# Altium schematic sheet XP-Hardv.SchDoc
size A4
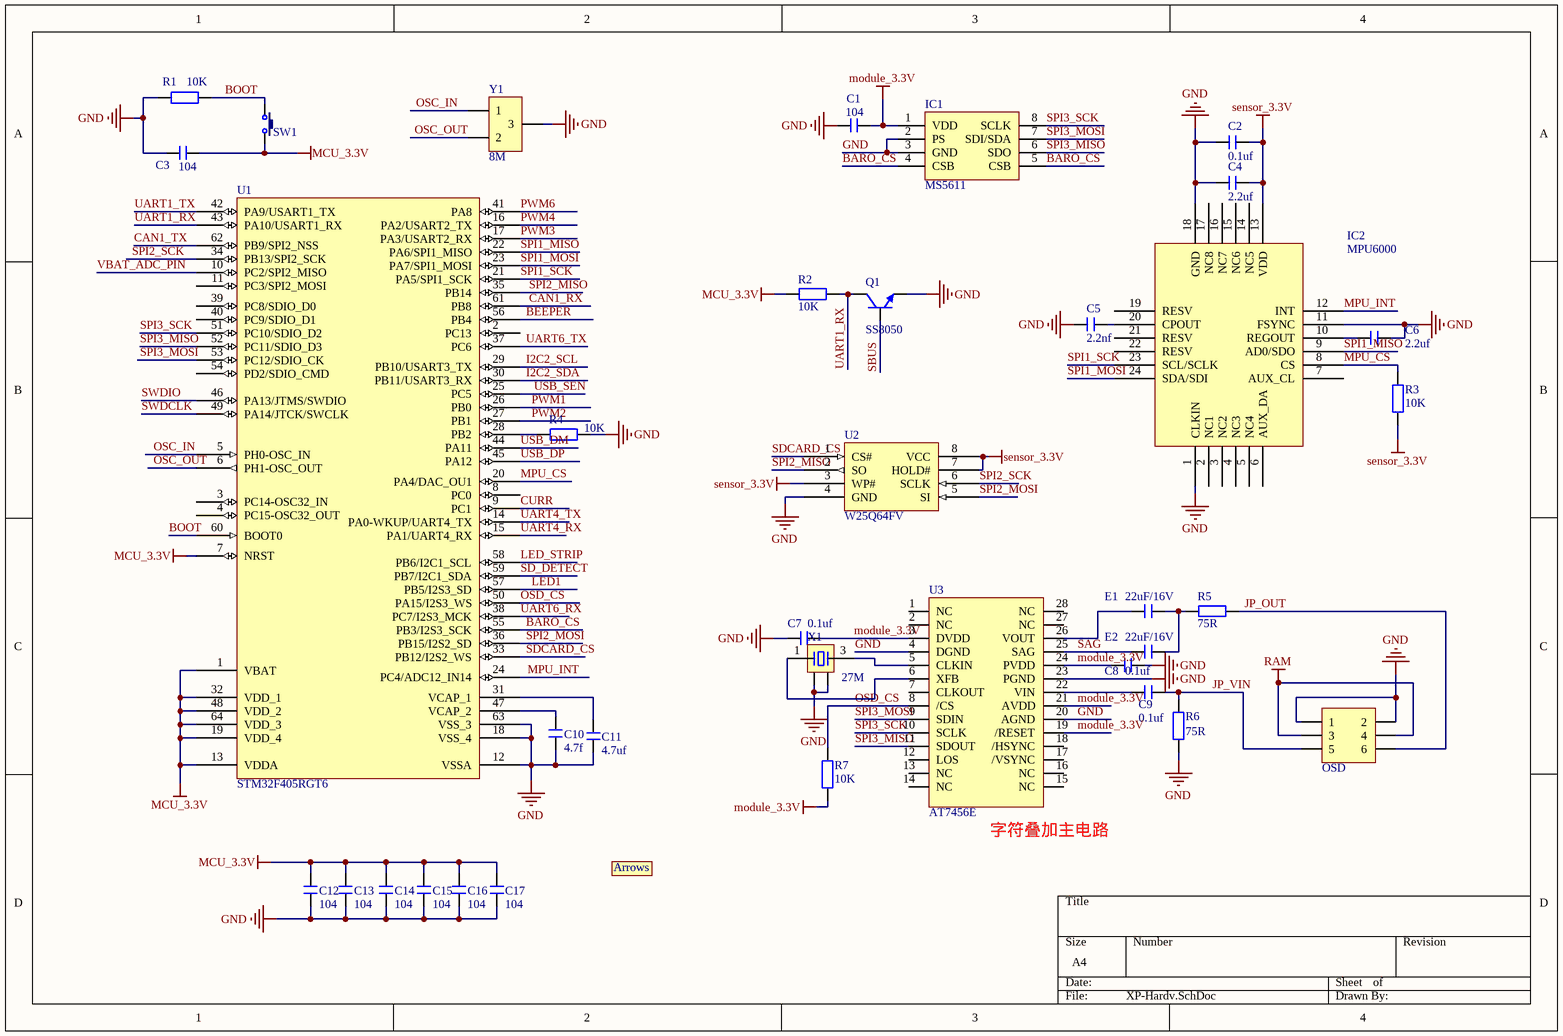
[diagram p0: XP-Hardv.SchDoc]

## Parts
C1  104  [C 0402_M]
C2  0.1uf  [C 0402_M]
C3  104  [C 0402_M]
C4  2.2uf  [C 0402_M]
C5  2.2nf  [C 0402_M]
C6  2.2uf  [C 0402_M]
C7  0.1uf  [C 0402_M]
C8  0.1uf  [C 0402_M]
C9  0.1uf  [C 0402_M]
C10  4.7f  [C 0402_M]
C11  4.7uf  [C 0402_M]
C12  104  [C 0402_M]
C13  104  [C 0402_M]
C14  104  [C 0402_M]
C15  104  [C 0402_M]
C16  104  [C 0402_M]
C17  104  [C 0402_M]
E1  22uF/16V  [C 0805_L]
E2  22uF/16V  [C 0805_L]
IC1  MS5611  [MS5611]
IC2  MPU6000  [MPU6050]
logo1  Arrows  [Arrows - E]  (value not drawn)
OSD  Header3X2  [PHD2.0-LI-2x3P]  (value not drawn)
Q1  SS8050  [SOT23-3M]
R1  10K  [R 0402_M]
R2  10K  [R 0402_M]
R3  10K  [R 0402_M]
R4  10K  [R 0402_M]
R5  75R  [R 0402_M]
R6  75R  [R 0402_M]
R7  10K  [R 0402_M]
SW1  3x6x5  [TSW 3*6*4.3-S-W]  (value not drawn)
U1  STM32F405RGT6  [LQFP64 10x10_N]
U2  W25Q64FV  [Q-WSON8_6x5]
U3  AT7456E  [AT7456E - B]
X1  27M  [OSC 3225-4P]
Y1  8M  [L - CSTCE-3213]

## Nets
GND: C1.2 C2.2 C3.1 C4.2 C5.2 C6.1 C7.1 C8.2 C10.1 C11.1 C12.1 C13.1 C14.1 C15.1 C16.1 C17.1 IC1.2(PS) IC1.3(GND) IC2.1(CLKIN) IC2.11(FSYNC) IC2.18(GND) OSD.1 OSD.2 Q1.2(E) R1.2 R4.2 R6.1 U1.12(VSSA) U1.18(VSS_4) U1.63(VSS_3) U2.4(GND) U3.4(DGND) U3.20(AGND) U3.23(PGND) X1.2 X1.4 Y1.3
MCU_3.3V: C3.2 C12.2 C13.2 C14.2 C15.2 C16.2 C17.2 R2.2 SW1.2 U1.1(VBAT) U1.7(NRST) U1.13(VDDA) U1.19(VDD_4) U1.32(VDD_1) U1.48(VDD_2) U1.64(VDD_3)
module_3.3V: C1.1 C7.2 C8.1 IC1.1(VDD) R7.1 U3.3(DVDD) U3.19(/RESET) U3.21(AVDD) U3.24(PVDD)
RAM: OSD.3 OSD.4
sensor_3.3V: C2.1 C4.1 IC2.13(VDD) R3.1 U2.3(WP#) U2.7(HOLD#) U2.8(VCC)
BARO_CS: IC1.4(CSB) IC1.5(CSB) U1.55(PB3/I2S3_SCK)
BEEPER: U1.56(PB4)
BOOT: R1.1 SW1.1 U1.60(BOOT0)
CAN1_RX: U1.61(PB8)
CAN1_TX: U1.62(PB9/SPI2_NSS)
CURR: U1.9(PC1)
I2C2_SCL: U1.29(PB10/USART3_TX)
I2C2_SDA: U1.30(PB11/USART3_RX)
JP_OUT: OSD.6 R5.2
JP_VIN: C9.2 OSD.5 R6.2
LED1: U1.57(PB5/I2S3_SD)
LED_STRIP: U1.58(PB6/I2C1_SCL)
MPU_CS: IC2.8(CS) R3.2 U1.20(PA4/DAC_OU1)
MPU_INT: IC2.12(INT) U1.24(PC4/ADC12_IN14)
OSC_IN: U1.5(PH0-OSC_IN) Y1.1
OSC_OUT: U1.6(PH1-OSC_OUT) Y1.2
OSD_CS: R7.2 U1.50(PA15/I2S3_WS) U3.8(/CS)
PWM1: U1.26(PB0)
PWM2: U1.27(PB1)
PWM3: U1.17(PA3/USART2_RX)
PWM4: U1.16(PA2/USART2_TX)
PWM6: U1.41(PA8)
SAG: E2.1 U3.25(SAG)
SBUS: Q1.1(B)
SD_DETECT: U1.59(PB7/I2C1_SDA)
SDCARD_CS: U1.33(PB12/I2S2_WS) U2.1(CS#)
SPI1_MISO: IC2.9(AD0/SDO) U1.22(PA6/SPI1_MISO)
SPI1_MOSI: IC2.24(SDA/SDI) U1.23(PA7/SPI1_MOSI)
SPI1_SCK: IC2.23(SCL/SCLK) U1.21(PA5/SPI1_SCK)
SPI2_MISO: U1.35(PB14) U2.2(SO)
SPI2_MOSI: U1.36(PB15/I2S2_SD) U2.5(SI)
SPI2_SCK: U1.34(PB13/SPI2_SCK) U2.6(SCLK)
SPI3_MISO: IC1.6(SDO) U1.52(PC11/SDIO_D3) U3.11(SDOUT)
SPI3_MOSI: IC1.7(SDI/SDA) U1.53(PC12/SDIO_CK) U3.9(SDIN)
SPI3_SCK: IC1.8(SCLK) U1.51(PC10/SDIO_D2) U3.10(SCLK)
SWDCLK: U1.49(PA14/JTCK/SWCLK)
SWDIO: U1.46(PA13/JTMS/SWDIO)
UART1_RX: Q1.3(C) R2.1 U1.43(PA10/USART1_RX)
UART1_TX: U1.42(PA9/USART1_TX)
UART4_RX: U1.15(PA1/UART4_RX)
UART4_TX: U1.14(PA0-WKUP/UART4_TX)
UART6_RX: U1.38(PC7/I2S3_MCK)
UART6_TX: U1.37(PC6)
USB_DM: U1.44(PA11)
USB_DP: U1.45(PA12)
USB_SEN: U1.25(PC5)
VBAT_ADC_PIN: U1.10(PC2/SPI2_MISO)
NetC5_1: C5.1 IC2.20(CPOUT)
NetC6_2: C6.2 IC2.10(REGOUT)
NetC9_1: C9.1 U3.22(VIN)
NetC10_2: C10.2 U1.47(VCAP_2)
NetC11_2: C11.2 U1.31(VCAP_1)
NetE1_1: E1.1 U3.26(VOUT)
NetE1_2: E1.2 E2.2 R5.1
NetR4_1: R4.1 U1.28(PB2)
NetU3_5: U3.5(CLKIN) X1.3
NetU3_6: U3.6(XFB) X1.1

Not connected (* = marked no-connect by the designer): IC2 2(NC1) 3(NC2) 4(NC3) 5(NC4) 6(AUX_DA) 7(AUX_CL) 14(NC5) 15(NC6) 16(NC7) 17(NC8) 19(RESV) 21(RESV) 22(RESV); U1 2(PC13) 3(PC14-OSC32_IN) 4(PC15-OSC32_OUT) 8(PC0) 11(PC3/SPI2_MOSI) 39(PC8/SDIO_D0) 40(PC9/SDIO_D1) 54(PD2/SDIO_CMD); U3 1(NC) 2(NC) 7(CLKOUT) 12(LOS) 13(NC) 14(NC) 15(NC) 16(NC) 17(/VSYNC) 18(/HSYNC) 27(NC) 28(NC)

## Notes on the sheet
- Labels drawn without touching a wire or pin: 字符叠加主电路

## Library data of the parts
C1-C17 E1 E2 = C: 无极性贴片电容; 版权归属: 源创客; BOM名称: 无极性贴片电容; 学习资源: www.ooocke.com
IC1 = MS5611: 气压传感器; 版权归属: 源创客; BOM名称: 气压传感器; 学习资源: www.ooocke.com
IC2 = MPU6000: 版权所有: 河池学院智能控制重点实验室; Library name: 传感器; 了解我们: http://www.jianshengdrlab.com
logo1 = Arrows: 名称: 箭头; 版权所有: 深圳市哈鸣科技有限公司; 说明: 无人机方向箭头
OSD = Header 3X2: 3*2P接插件; 版权归属: 源创客; BOM名称: 3*2P接插件; 学习资源: www.ooocke.com
Q1 = 8050-SMD: 高频放大-NPN型; 版权归属: 源创客; 属性: 40V 1.5A 1W 100MHZ; BOM名称: 高频放大-NPN型; 学习资源: www.ooocke.com
R1-R7 = R: 贴片电阻; 版权归属: 源创客; BOM名称: 贴片电阻; 学习资源: www.ooocke.com
SW1 = TSW 3x6: 3x6轻触开关; 版权归属: 源创客; BOM名称: 3x6轻触开关; 学习资源: www.ooocke.com
U1 = STM32F405RGT6: 32位STM单片机
U2 = W25Q64FV: 存储器芯片-64M
U3 = AT7456E: 版权所有: 河池学院智能控制重点实验室; Library name: 字符叠加芯片; 了解我们: http://www.jianshengdrlab.com
X1 = XTAL-4P: 4脚无源晶振; 版权归属: 源创客; BOM名称: 4脚无源晶振; 学习资源: www.ooocke.com
Y1 = CSTCE: BOM名称: 3脚无源晶振; 版权归属: Ly